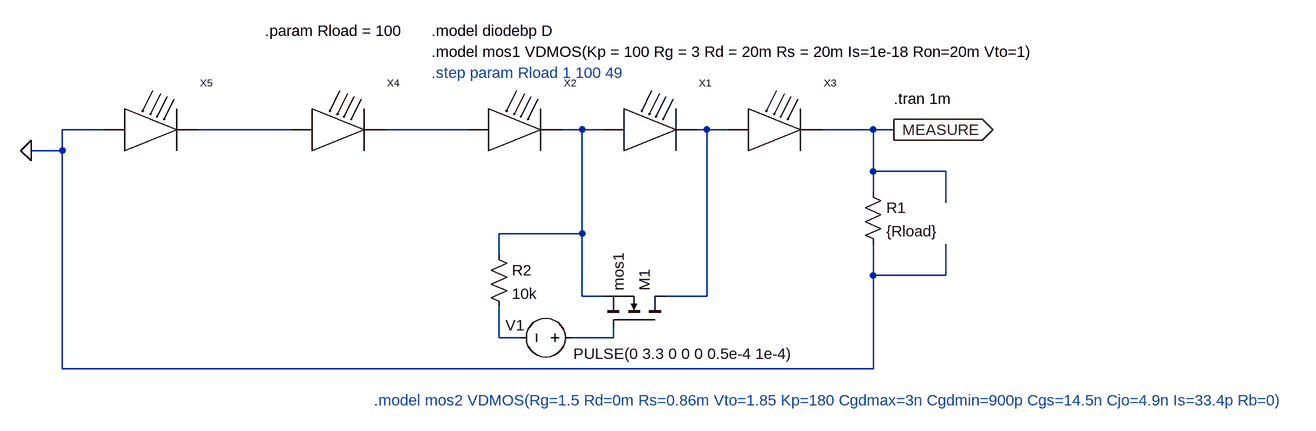
[diagram p0: schematic shortcircuit-single.asc]
shortcircuit-single.asc, the LTspice schematic file:
Version 4
SHEET 1 1392 876
WIRE -816 144 -880 144
WIRE -528 144 -672 144
WIRE -256 144 -384 144
WIRE -80 144 -112 144
WIRE -48 144 -80 144
WIRE 112 144 96 144
WIRE 144 144 112 144
WIRE 368 144 288 144
WIRE 400 144 368 144
WIRE -880 176 -880 144
WIRE -880 176 -928 176
WIRE 368 208 368 144
WIRE 480 208 368 208
WIRE 368 240 368 208
WIRE 480 256 480 208
WIRE -80 304 -80 144
WIRE -80 304 -208 304
WIRE -208 336 -208 304
WIRE 368 368 368 320
WIRE 480 368 480 320
WIRE 480 368 368 368
WIRE -80 400 -80 304
WIRE -48 400 -80 400
WIRE 112 400 112 144
WIRE 112 400 48 400
WIRE -208 464 -208 416
WIRE -176 464 -208 464
WIRE -32 464 -32 448
WIRE -32 464 -96 464
WIRE -880 512 -880 176
WIRE 368 512 368 368
WIRE 368 512 -880 512
FLAG 400 144 MEASURE
IOPIN 400 144 Out
FLAG -928 176 0
SYMBOL nmos 48 448 M270
SYMATTR InstName M1
SYMATTR Value mos1
SYMBOL voltage -80 464 M270
WINDOW 0 19 118 VLeft 2
WINDOW 3 -25 -327 VRight 2
WINDOW 123 0 0 Left 2
WINDOW 39 0 0 Left 2
SYMATTR InstName V1
SYMATTR Value PULSE(0 3.3 0 0 0 0.5e-4 1e-4)
SYMBOL jacModule 16 144 R0
SYMATTR InstName X1
SYMBOL res 352 224 R0
SYMATTR InstName R1
SYMATTR Value {Rload}
SYMBOL jacModule -192 144 R0
SYMATTR InstName X2
SYMBOL jacModule 208 144 R0
SYMATTR InstName X3
SYMBOL jacModule -464 144 R0
SYMATTR InstName X4
SYMBOL jacModule -752 144 R0
SYMATTR InstName X5
SYMBOL res -224 320 R0
SYMATTR InstName R2
SYMATTR Value 10k
TEXT 400 96 Left 2 !.tran 1m
TEXT -312 24 Left 2 !.model mos1 VDMOS(Kp = 100 Rg = 3 Rd = 20m Rs = 20m Is=1e-18 Ron=20m Vto=1)
TEXT -312 -8 Left 2 !.model diodebp D
TEXT -312 56 Left 2 ;.step param Rload 1 100 49
TEXT -400 560 Left 2 ;.model mos2 VDMOS(Rg=1.5 Rd=0m Rs=0.86m Vto=1.85 Kp=180 Cgdmax=3n Cgdmin=900p Cgs=14.5n Cjo=4.9n Is=33.4p Rb=0)
TEXT -568 -8 Left 2 !.param Rload = 100

The netlist it stands for:
* shortcircuit-single.asc
M1 N004 N006 N003 N003 mos1
V1 N006 N005 PULSE(0 3.3 0 0 0 0.5e-4 1e-4)
XX1 N003 N004 jacModule  ; pins modIN modOUT
R1 MEASURE 0 {Rload}
XX2 N002 N003 jacModule  ; pins modIN modOUT
XX3 N004 MEASURE jacModule  ; pins modIN modOUT
XX4 N001 N002 jacModule  ; pins modIN modOUT
XX5 0 N001 jacModule  ; pins modIN modOUT
R2 N003 N005 10k
.model NMOS NMOS
.model PMOS PMOS
.lib standard.mos
.tran 1m
.model mos1 VDMOS(Kp = 100 Rg = 3 Rd = 20m Rs = 20m Is=1e-18 Ron=20m Vto=1)
.model diodebp D
* .step param Rload 1 100 49
* .model mos2 VDMOS(Rg=1.5 Rd=0m Rs=0.86m Vto=1.85 Kp=180 Cgdmax=3n Cgdmin=900p Cgs=14.5n Cjo=4.9n Is=33.4p Rb=0)
.param Rload = 100
.backanno
.end